# EAGLE schematic Nixie4_IN-1A_1_0 (EAGLE 7.6.0)
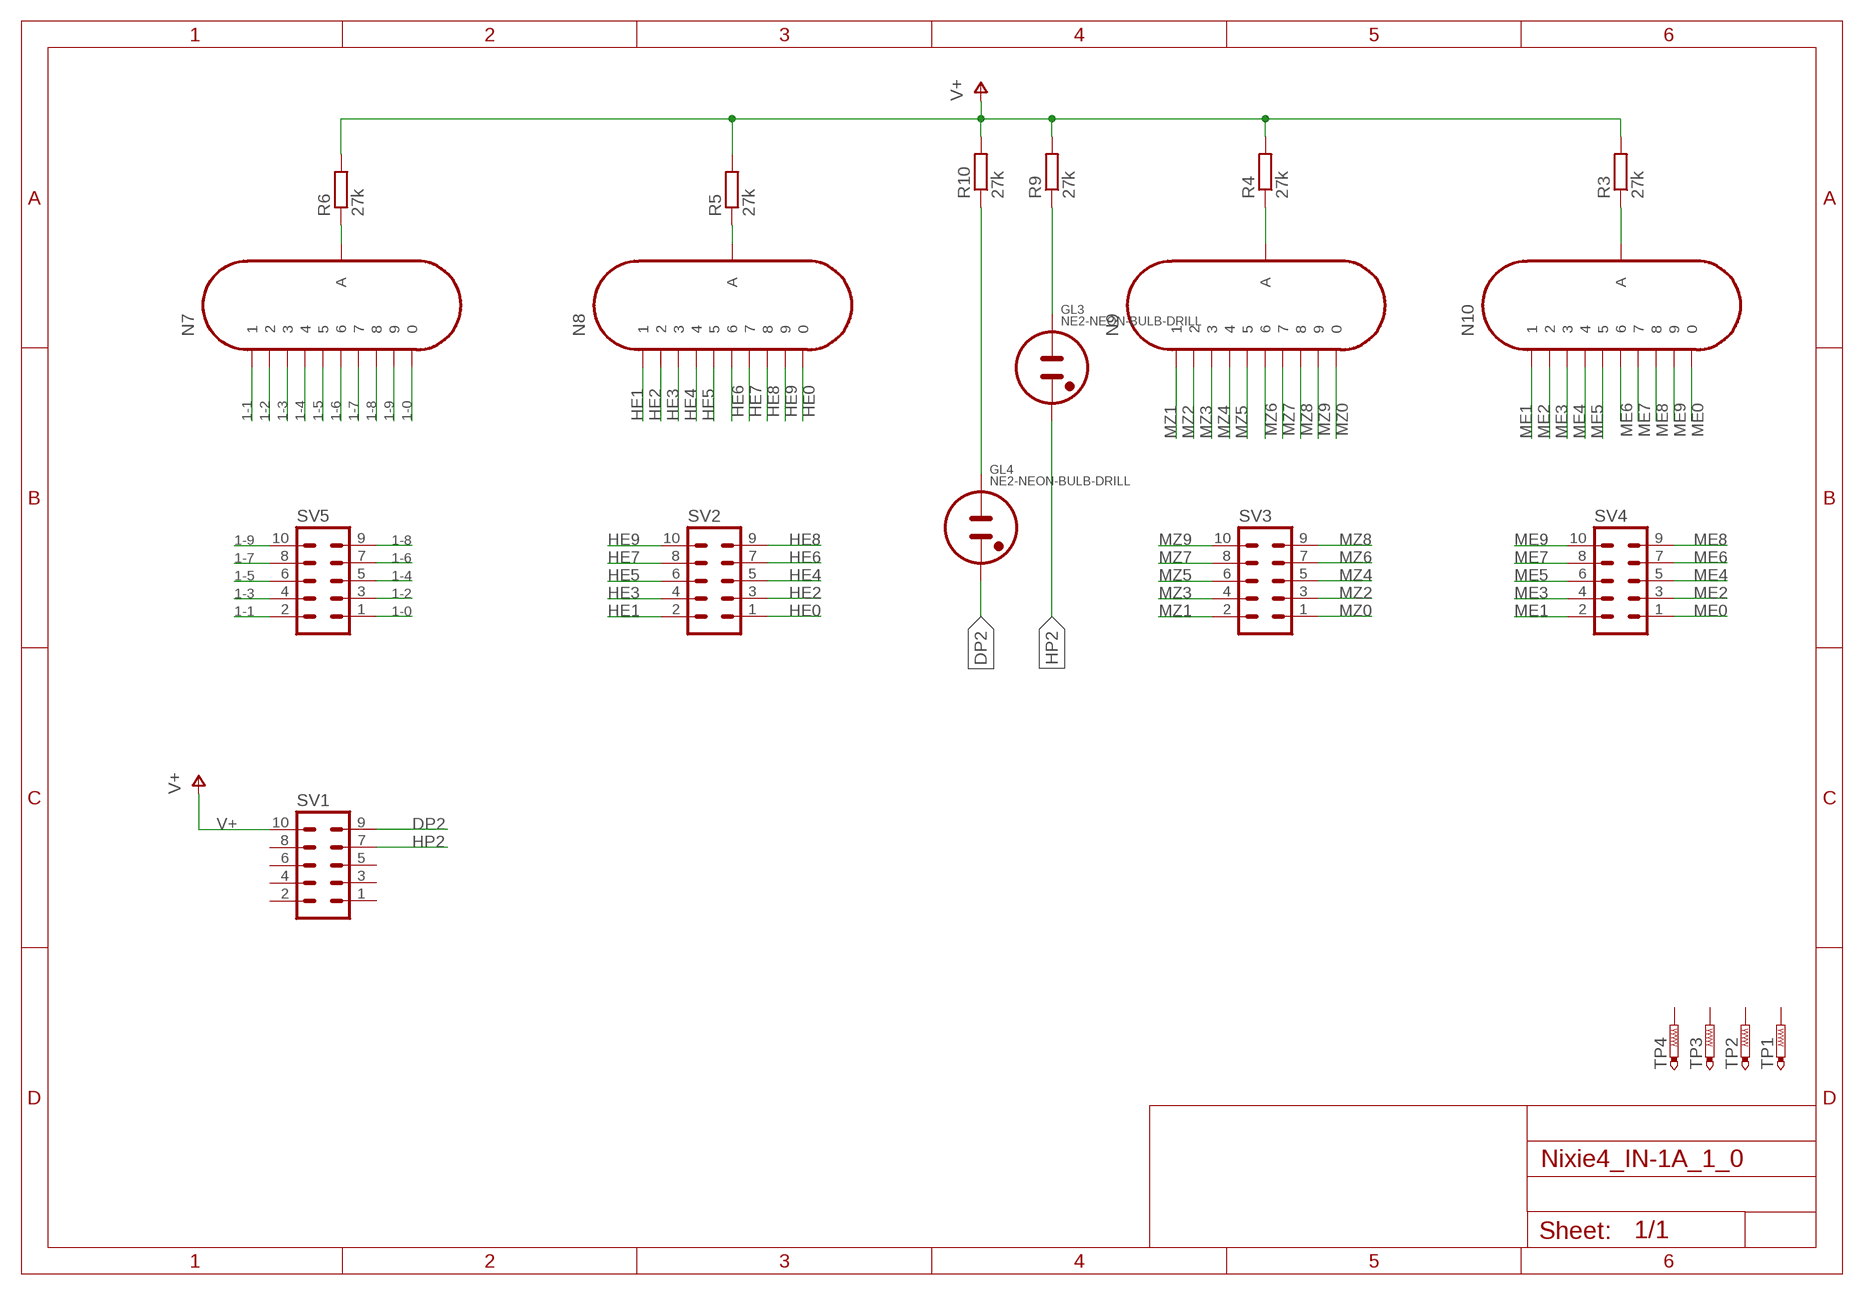
[diagram p0: schematic, sheet 1]

## Parts
GL3  NE2-NEON-BULB-DRILL  [NE2-NEON-BULB-DRILL]
GL4  NE2-NEON-BULB-DRILL  [NE2-NEON-BULB-DRILL]
N7  IN-1A  [IN-1A]
N8  IN-1A  [IN-1A]
N9  IN-1A  [IN-1A]
N10  IN-1A  [IN-1A]
R3  27k  R-EU_0207/10  [0207/10]
R4  27k  R-EU_0207/10  [0207/10]
R5  27k  R-EU_0207/10  [0207/10]
R6  27k  R-EU_0207/10  [0207/10]
R9  27k  R-EU_0207/10  [0207/10]
R10  27k  R-EU_0207/10  [0207/10]
SV1  ML10  [ML10]
SV2  ML10  [ML10]
SV3  ML10  [ML10]
SV4  ML10  [ML10]
SV5  ML10  [ML10]
TP1  PTR1B1,27  [B1,27]
TP2  PTR1B1,27  [B1,27]
TP3  PTR1B1,27  [B1,27]
TP4  PTR1B1,27  [B1,27]

## Nets
1-0: N7.0 SV5.1
1-1: N7.1 SV5.2
1-2: N7.2 SV5.3
1-3: N7.3 SV5.4
1-4: N7.4 SV5.5
1-5: N7.5 SV5.6
1-6: N7.6 SV5.7
1-7: N7.7 SV5.8
1-8: N7.8 SV5.9
1-9: N7.9 SV5.10
DP2: GL4.2(A1) SV1.9
HE0: N8.0 SV2.1
HE1: N8.1 SV2.2
HE2: N8.2 SV2.3
HE3: N8.3 SV2.4
HE4: N8.4 SV2.5
HE5: N8.5 SV2.6
HE6: N8.6 SV2.7
HE7: N8.7 SV2.8
HE8: N8.8 SV2.9
HE9: N8.9 SV2.10
HP2: GL3.2(A1) SV1.7
ME0: N10.0 SV4.1
ME1: N10.1 SV4.2
ME2: N10.2 SV4.3
ME3: N10.3 SV4.4
ME4: N10.4 SV4.5
ME5: N10.5 SV4.6
ME6: N10.6 SV4.7
ME7: N10.7 SV4.8
ME8: N10.8 SV4.9
ME9: N10.9 SV4.10
MZ0: N9.0 SV3.1
MZ1: N9.1 SV3.2
MZ2: N9.2 SV3.3
MZ3: N9.3 SV3.4
MZ4: N9.4 SV3.5
MZ5: N9.5 SV3.6
MZ6: N9.6 SV3.7
MZ7: N9.7 SV3.8
MZ8: N9.8 SV3.9
MZ9: N9.9 SV3.10
N$1: N7.A R6.1
N$4: N10.A R3.1
N$5: N9.A R4.1
N$7: N8.A R5.1
N$11: GL4.1(A) R10.1
N$13: GL3.1(A) R9.1
V+: R3.2 R4.2 R5.2 R6.2 R9.2 R10.2 SV1.10
Unconnected: SV1.1 SV1.2 SV1.3 SV1.4 SV1.5 SV1.6 SV1.8 TP1.TP TP2.TP TP3.TP TP4.TP

## Library data of the parts
GL3 GL4 = nixies:NE2-NEON-BULB: Neon indicator (wire connection)
N7-N10 = russian-nixies:IN-1A
R3-R6 R9 R10 = rcl:R-EU_: RESISTOR, European symbol
SV1-SV5 = con-harting-ml:ML10: HARTING; OC_FARNELL: unknown; OC_NEWARK: unknown
TP1-TP4 = testpad:PTR1: TEST PIN